# Altium schematic sheet LoRaBoard_2.SchDoc
size 410 x 297 mm; DocumentNumber: ABCD.000001.600.Э3; SheetNumber: 2; SheetTotal: 3; _DecimalNumber: ABCD.000001.600.Э3; _Sheet: 2; PageSetup: Record=PageOptions|CenterHorizontal=False|CenterVertical=False|PrintScale=1.00|XCorrection=1.00|YCorrection=1.00|PrintKind=0|BorderSize=5000000|LeftOffset=0|BottomOffset=0|Orientation=2|PaperLength=1000|PaperWidth=1000|Scale=100|PaperSource=7|PrintQuality=-3|MediaType=1|DitherType=10|PrintScaleMode=0|PaperKind=A3|PaperIndex=8
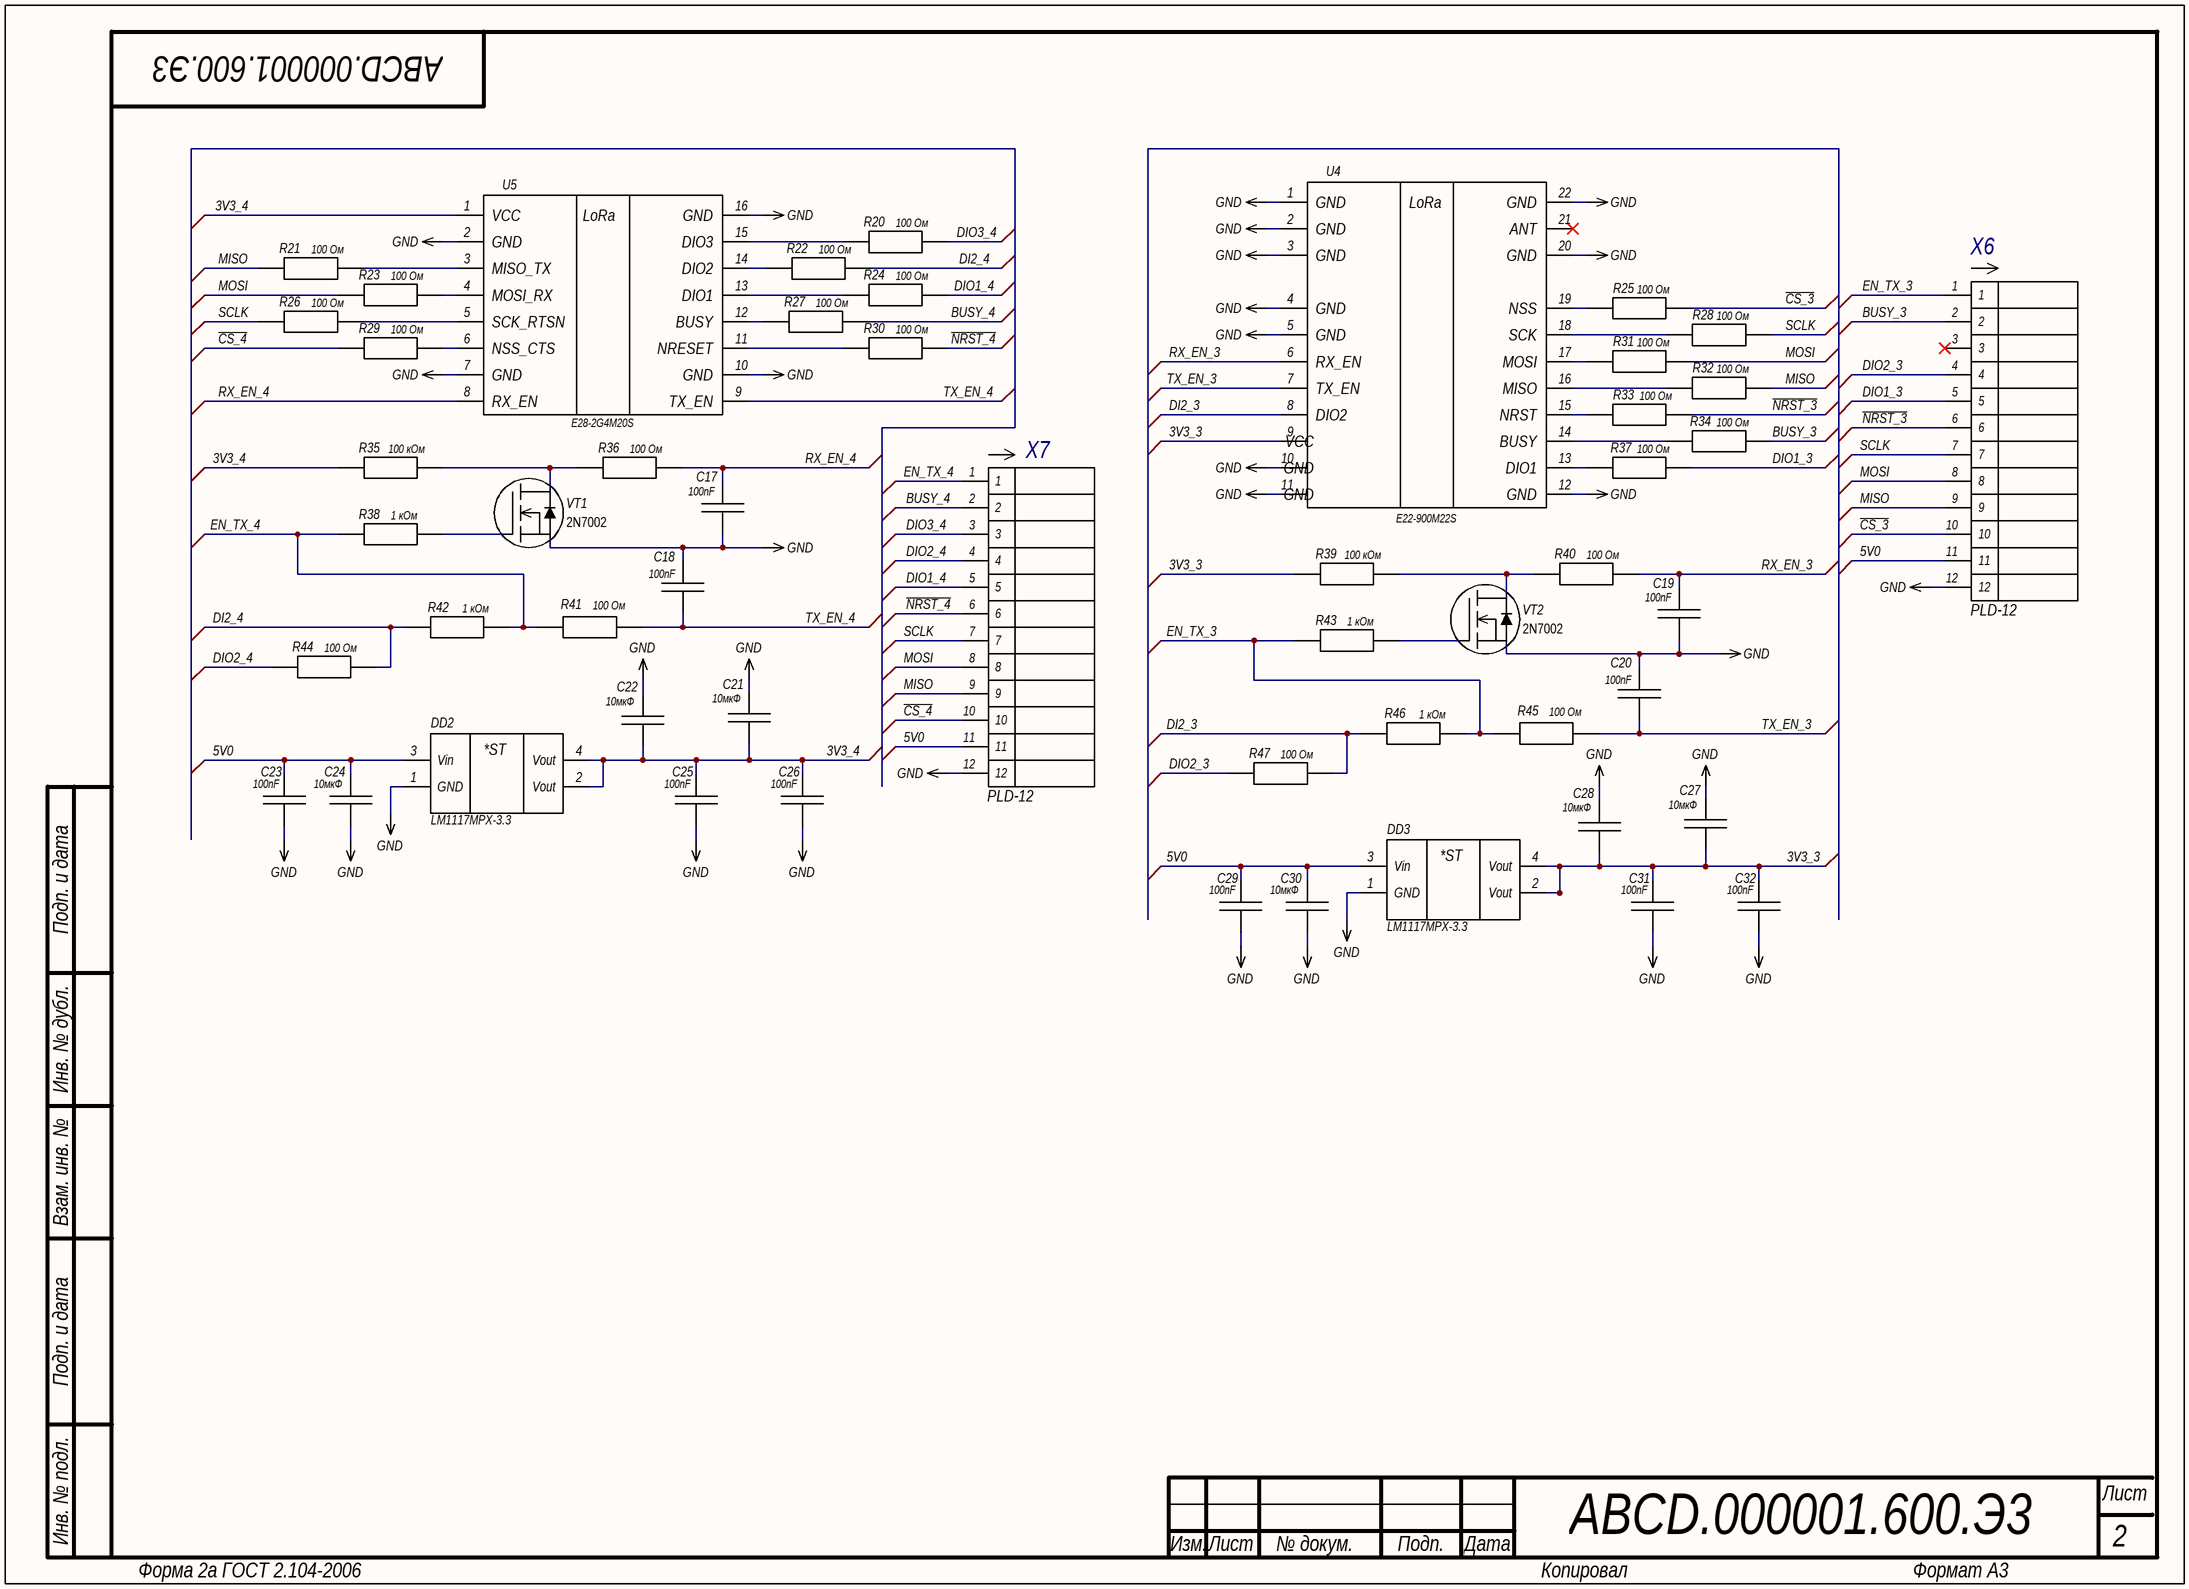
[diagram p0: LoRaBoard_2.SchDoc]

## Parts
C17  100nF  [CAP 0603_1608 RF]
C18  100nF  [CAP 0603_1608 RF]
C19  100nF  [CAP 0603_1608 RF]
C20  100nF  [CAP 0603_1608 RF]
C21  10мкФ  [CAP 0805]
C22  10мкФ  [CAP 0805]
C23  100nF  [CAP 0603_1608 RF]
C24  10мкФ  [CAP 0805]
C25  100nF  [CAP 0603_1608 RF]
C26  100nF  [CAP 0603_1608 RF]
C27  10мкФ  [CAP 0805]
C28  10мкФ  [CAP 0805]
C29  100nF  [CAP 0603_1608 RF]
C30  10мкФ  [CAP 0805]
C31  100nF  [CAP 0603_1608 RF]
C32  100nF  [CAP 0603_1608 RF]
DD2  LM1117MPX-3.3  [SOT223]
DD3  LM1117MPX-3.3  [SOT223]
R20  100 Ом  [RES 0603_1608]
R21  100 Ом  [RES 0603_1608]
R22  100 Ом  [RES 0603_1608]
R23  100 Ом  [RES 0603_1608]
R24  100 Ом  [RES 0603_1608]
R25  100 Ом  [RES 0603_1608]
R26  100 Ом  [RES 0603_1608]
R27  100 Ом  [RES 0603_1608]
R28  100 Ом  [RES 0603_1608]
R29  100 Ом  [RES 0603_1608]
R30  100 Ом  [RES 0603_1608]
R31  100 Ом  [RES 0603_1608]
R32  100 Ом  [RES 0603_1608]
R33  100 Ом  [RES 0603_1608]
R34  100 Ом  [RES 0603_1608]
R35  100 кОм  [RES 0603_1608]
R36  100 Ом  [RES 0603_1608]
R37  100 Ом  [RES 0603_1608]
R38  1 кОм  [RES 0603_1608]
R39  100 кОм  [RES 0603_1608]
R40  100 Ом  [RES 0603_1608]
R41  100 Ом  [RES 0603_1608]
R42  1 кОм  [RES 0603_1608]
R43  1 кОм  [RES 0603_1608]
R44  100 Ом  [RES 0603_1608]
R45  100 Ом  [RES 0603_1608]
R46  1 кОм  [RES 0603_1608]
R47  100 Ом  [RES 0603_1608]
U4  E22-900M22S  [E22 900M22S]
U5  E28-2G4M20S  [E28 2G4M20S]
VT1  2N7002  [SOT23-3]
VT2  2N7002  [SOT23-3]
X6  value PLD-12  [PLD_12_elipse]  (hidden comment: PLD-12 (DS1021-2x6))
X7  value PLD-12  [PLD_12_elipse]  (hidden comment: PLD-12 (DS1021-2x6))

## Nets
GND: C17.1 C18.2 C19.1 C20.2 C21.1 C22.1 C23.1 C24.1 C25.1 C26.1 C27.1 C28.1 C29.1 C30.1 C31.1 C32.1 DD2.1(GND) DD3.1(GND) U4.1 U4.2 U4.3 U4.4 U4.5 U4.10 U4.11 U4.12 U4.20 U4.22 U5.2 U5.7 U5.10 U5.16 VT1.2(S) VT2.2(S) X6.12 X7.12
3V3_3: C27.2 C28.2 C31.2 C32.2 DD3.2(Vout) DD3.4(Vout) R39.1 U4.9
3V3_4: C21.2 C22.2 C25.2 C26.2 DD2.2(Vout) DD2.4(Vout) R35.1 U5.1
5V0: C23.2 C24.2 C29.2 C30.2 DD2.3(Vin) DD3.3(Vin) X6.11 X7.11
BUSY_3: R34.2 X6.2
BUSY_4: R27.2 X7.2
~{CS_3}: R25.2 X6.10
~{CS_4}: R29.1 X7.10
DI2_3: R46.1 R47.2 U4.8
DI2_4: R22.2 R42.1 R44.2
DIO1_3: R37.2 X6.5
DIO1_4: R24.2 X7.5
DIO2_3: R47.1 X6.4
DIO2_4: R44.1 X7.4
DIO3_4: R20.2 X7.3
EN_TX_3: R43.1 R45.1 R46.2 X6.1
EN_TX_4: R38.1 R41.1 R42.2 X7.1
MISO: R21.1 R32.2 X6.9 X7.9
MOSI: R23.1 R31.2 X6.8 X7.8
~{NRST_3}: R33.2 X6.6
~{NRST_4}: R30.2 X7.6
RX_EN_3: C19.2 R40.2 U4.6
RX_EN_4: C17.2 R36.2 U5.8
SCLK: R26.1 R28.2 X6.7 X7.7
TX_EN_3: C20.1 R45.2 U4.7
TX_EN_4: C18.1 R41.2 U5.9
NetR20_1: R20.1 U5.15
NetR21_2: R21.2 U5.3
NetR22_1: R22.1 U5.14
NetR23_2: R23.2 U5.4
NetR24_1: R24.1 U5.13
NetR25_1: R25.1 U4.19
NetR26_2: R26.2 U5.5
NetR27_1: R27.1 U5.12
NetR28_1: R28.1 U4.18
NetR29_2: R29.2 U5.6
NetR30_1: R30.1 U5.11
NetR31_1: R31.1 U4.17
NetR32_1: R32.1 U4.16
NetR33_1: R33.1 U4.15
NetR34_1: R34.1 U4.14
NetR35_2: R35.2 R36.1 VT1.3(D)
NetR37_1: R37.1 U4.13
NetR38_2: R38.2 VT1.1(G)
NetR39_2: R39.2 R40.1 VT2.3(D)
NetR43_2: R43.2 VT2.1(G)

Not connected (* = marked no-connect by the designer): U4 21*; X6 3*

## Notes on the sheet
- Подп. и дата
- Инв. № дубл.
- Взам. инв. №
- Инв. № подл.
- Изм.
- Лист
- № докум.
- Подп.
- Дата
- Форма 2а ГОСТ 2.104-2006
- Копировал
- Формат А3
- (in symbol E22-900M22S) GND; LoRa; ANT; NSS; SCK; RX_EN; MOSI; TX_EN; MISO; DIO2; NRST; VCC; BUSY; DIO1
- (in symbol E28-2G4M20S) VCC; LoRa; GND; DIO3; MISO_TX; DIO2; MOSI_RX; DIO1; SCK_RTSN; BUSY; NSS_CTS; NRESET; RX_EN; TX_EN
- (in symbol LM1117MPX-3.3) *ST

## Library data of the parts
C17-C20 C23 C25 C26 C29 C31 C32 = Capacitor: CC0603JPX7R9BB104, 50V 100nF X7R 5% 0603; Vendor Code: *; Value: 100nF; Part Number: CC0603JPX7R9BB104
C21 C22 C24 C27 C28 C30 = Capacitor: 10мкФ X5R 16В 10% 0805, CC0805KKX5R7BB106; Vendor Code: *; Value: 10мкФ; Part Number: CC0805KKX5R7BB106
DD2 DD3 = LM1117MPX-3.3: 800mA Low-Dropout Linear Regulator; Vendor Code: *; Value: LM1117MPX-3.3
R20-R34 R36 R37 R40 R41 R44 R45 R47 = Resistor: 0.1Вт 0603 100 Ом, 5%, RC0603JR-07100RL; Type: Резистор; Vendor Code: *; Value: 100 Ом; Part Number: RC0603JR-07100RL
R35 R39 = Resistor: 0.1Вт 0603 100 кОм, 5%, RC0603JR-071KL; Part Number: RC0603JR-07100KL; Type: Резистор; Vendor Code: *; Value: 100 кОм
R38 R42 R43 R46 = Resistor: 0.1Вт 0603 1 кОм, 5%, RC0603JR-071KL; Type: Резистор; Vendor Code: *; Value: 1 кОм; Part Number: RC0603JR-071KL
U4 = E22-900M22S: E22-900M22S Ebyte -147dBm 22.3dBm 7km SPI SMD,14x20mm LoRa Modules; Pitch: 1.27; Part Number: E22-900M22S; Value: E22-900M22S; Package: 14x20mm; Temperature Range: -40…+85 °C; Manufacturer: EBYTE; Number of Rows: 2; Number of Pins: 22
U5 = E28-2G4M20S: E28-2G4M20S Ebyte  -132dBm 21dBm 6km SPI SMD,15x26.5mm LoRa Modules; Pitch: 1.27; Part Number: E28-2G4M20S; Value: E28-2G4M20S; Package: 15x26.5mm; Temperature Range: -40…+85 °C; Manufacturer: EBYTE; Number of Rows: 2; Number of Pins: 16
VT1 VT2 = 2N7002ET1G: MOSFET-N-60V-0.3A; Manufacturer: ON Semiconductor; Number of Channels: 1; Polarity: N-Channel; Drain Source Voltage: 60V; Drain Current: 0.3A; On Drain Source Resistance: 0.2Ohm; Gate Source Voltage: ±20V; Power Disspansion: 0.5W; Part Number: 2N7002ET1G; Value: 2N7002; Package: SOT-23; Temperature Range: -55…+150°C
X6 X7 = PLD-12: 2.54mm PIN Header 2X6P Straight Type H=2.5mm Full Gold Flash Plating.; Published: 07.03.2013; Publisher: Andrew Danich; Type: Вилка